# Altium schematic sheet Buck converter_ADJ.SchDoc
size A; SheetNumber: 2; SheetTotal: 3
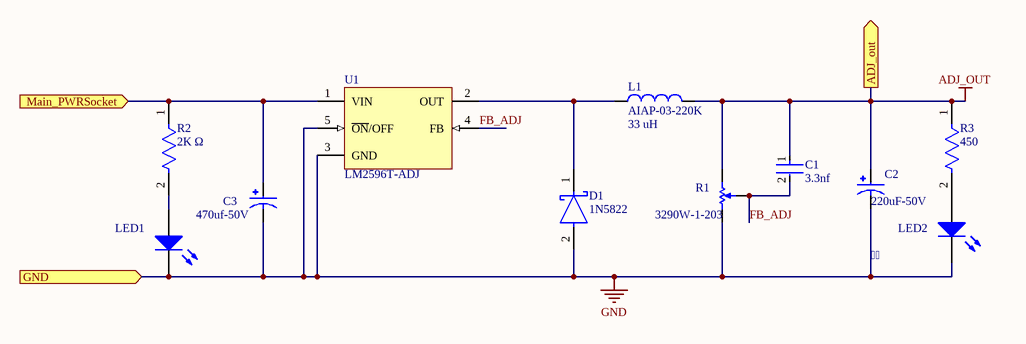
[diagram p0: Buck converter_ADJ.SchDoc]

## Parts
C1  3.3nf  [FP-RCE0K1-MFG]
C2  220uF-50V  [CAPPRD500W60D1000H1600]
C3  470uf-50V  [CAPPRD500W60D1250H2000]
D1  1N5822  [FP-DO-201AD-MFG]
L1  AIAP-03-220K  Inductance: 33 uH  [ABRA-AIAP-02-2_V2]
LED1  (no value)  [Type 5mm]
LED2    [Type 5mm]
R1  3290W-1-203  [BOUR-3290W]
R2  value 2K Ω  [FP-MFR-25-MFG]  (hidden comment: MFR-25FBF52-1K18)
R3  value 450  [FP-MFR-25-MFG]  (hidden comment: MFR-25FBF52-1K18)
U1  LM2596T-ADJ  [NDH0005A]

## Ports
ADJ_out (out), GND (in), Main_PWRSocket (in)

## Nets
ADJ_OUT: C1.1 C2.P L1.2 R1.3 R3.1 ; port ADJ_out
GND: C2.N C3.N D1.2(A) LED1.1(K) LED2.1(K) R1.1 U1.3(GND) U1.5(~{ON}/OFF) ; port GND
FB_ADJ: C1.2 R1.2 U1.4(FB)
Main_PWRSocket: C3.P R2.1 U1.1(VIN) ; port Main_PWRSocket
NetD1_1: D1.1(C) L1.1 U1.2(OUT)
NetLED1_2: LED1.2(A) R2.2
NetLED2_2: LED2.2(A) R3.2

## Library data of the parts
C1 = CMP-06035-016735-1: Cap Ceramic 15pF 50V C0G ±5% Radial 5mm +125°C Automotive Bulk; Lead/Base Style: Formed Leads; Lead Diameter: 0.5mm; Height: 3.5mm; Ratings: AEC-Q200; Lead Pitch: 0.197inch; Termination: Radial; Packaging: Tape and Reel; Voltage Rating (DC): 50V; Length: 0.142inch; Width: 0.098inch; Tolerance: 5%; Package Quantity: 2000; Min Operating Temperature: -55°C; Height - Seated (Max): 0.138inch; Voltage Rating: 50V; Capacitance: 15pF; Case/Package: Radial; Max Operating Temperature: 125°C; Resistor Type: Ceramic; Mount: Through Hole; Dielectric: C0G
C2 = EEUFM1H221: FM-A; MF: {'manufacturer': u'Panasonic'}; Price: None; Availability: Unavailable; MP: EEUFM1H221; Package: None; Value: *
C3 = EEUFM1H471: FM-A; MF: {'manufacturer': u'Panasonic'}; Price: None; Availability: Unavailable; Value: *; MP: EEUFM1H471; Package: None
D1 = CMP-12187-000025-1: DIODE SCHOTTKY 40V 3A DO201AD; Manufacturer: STMicroelectronics; Max Junction Temp: +150°C; Peak Reverse Current: 2mA; Max Surge Forward Current: 80A; Temperature Range High: +150°C; Automotive: No; RoHS: TRUE; ComponentLink2Description: Datasheet; Manufacturer Part Number: 1N5822; Lead Free: Yes; Octopart: https://octopart.com/1n5822-stmicroelectronics-323225; Device Class L2: Diodes; Max Repetitive Reverse Voltage: 40V; Temperature: to +150°C; Height: 5.3mm; Category: Diode; Digikey Description: DIODE SCHOTTKY 40V 3A DO201AD; ComponentLink2URL: https://www.st.com/resource/en/datasheet/1n5822.pdf; Device Class L3: Schottky Diodes; Device Class L1: Discrete Semiconductors; Forward Current: 3A; Mouser Description: Schottky Diodes & Rectifiers Vr/40V Io/3A BULK; Package: DO-201AD
L1 = CMP-0740-00001-1: Axial Power Inductor, 1000 uH +/- 10%, 0.4 A Max, 2.3 Ohm Max, -40 to 85 degC, 6.4 mm Dia x 14 mm Length, RoHS, Bag; PartNumber: AIAP-02-102K; Manufacturer: Abracon; DCR Max: 2.3 Ohm; IDC Max: 0.4 A; Tolerance: +/- 10%; ComponentLink2Description: Datasheet; ComponentLink3Description: Package Specification; RoHS: TRUE; Operating Temperature: -40 to 85 degC; ComponentLink1Description: Manufacturer URL; PackageVersion: Rev. 02.12.12; PackageReference: AIAP-02-2; ComponentLink1URL: http://www.abracon.com/; DatasheetVersion: 2/12/2012; ComponentLink2URL: http://www.abracon.com/Magnetics/axial/AIAP-02.pdf; Packing: Bag; PackageDescription: 2-Pin Axial Leaded, Dia 6.4 mm, Length 14 mm; Mounting Technology: Through Hole; ComponentLink3URL: http://www.abracon.com/Magnetics/axial/AIAP-02.pdf
LED1 LED2 = CMP-1488-00007-1: THT LED round mono-color color lens, WL-TMRW, Bright Green; PartNumber: 151051VS04000; Manufacturer: Wuerth Elektronik; Emitting color: Bright Green; ComponentLink1Description: Manufacturer URL; PackageReference: Type 5mm; ComponentLink2URL: http://katalog.we-online.de/pbs/datasheet/7448042001.pdfhttp://katalog.we-online.de/pbs/datasheet/7448042001.pdfhttp://katalog.we-online.de/pbs/datasheet/7448042001.pdfhttp://katalog.we-online.de/pbs/datasheet/151051VS04000.pdf; ComponentLink1URL: http://www.we-online.com; ComponentLink2Description: Datasheet
R1 = CMP-2000-05581-1: Trimming Potentiometer, 20 KOhm, 1 W, -65 to 150 degC, 3-Pin THD, RoHS, Tube; Manufacturer: Bourns; No. of Turns: 25; Potentiometer Mounting: ThroughHole; Temperature Coefficient: ±50ppm/°C; Power Rating: 1W; SVHC: NoSVHC(15-Jun-2015); Resistance Tolerance: ±5%; Product Range: AEC-Q2003290WSeries; Track Resistance: 20kohm; Datasheet URL: http://www.bourns.com/docs/Product-Datasheets/3290.pdf; Datasheet Version: 04/2014; Mounting Technology: ThroughHole; Package Description: 3-Pin Through Hole Device, Body 9.53 x 3.81 mm, Pitch 2.54 mm; Manufacturer URL: http://www.bourns.com/; Package Reference: 3290W
R2 R3 = CMP-03413-000001-1: RES 1.18K OHM 1/4W 1% AXIAL; Manufacturer: Yageo; Temperature Coefficient: 100ppm/°C; Power Rating: 0.25W; Voltage Rating: 250V; Resistance: 10K Ω; Temperature: -55°C to +155°C; Automotive: No; Temperature Range High: +155°C; Mouser Description: Metal Film Resistors 1.18K OHM 1/4W 1%; Digikey Description: RES 1.18K OHM 1/4W 1% AXIAL; Lead Free: Yes; Tolerance: 1%; ComponentLink2Description: Datasheet; ComponentLink2URL: https://www.yageo.com/upload/media/product/products/datasheet/lr/Yageo_LR_MFR_1.pdf; Temperature Range Low: -55°C; Package: MFR-25; Ipc Land Pattern Name: RESAD1000W75L680D260; Composition: Metal Film; Category: Res; Octopart: https://octopart.com/mfr-25fbf52-1k18-yageo-56251681; Series: MFR; Device Class L2: Resistors; Height: 2.6mm; Device Class L3: Through-Hole Resistors; Manufacturer Part Number: MFR-25FBF52-1K18; RoHS: TRUE; Device Class L1: Passive Components
U1 = CMP-0069-01927-3: SIMPLE SWITCHER® Power Converter 150 KHz 3A Step-Down Voltage Regulator, 5-pin TO-220; Manufacturer: Texas Instruments; PackageTopMarking: NSUZXYTTE#*LM2596T*-ADJ P+; PowerWise: N; CompType: Switcher; RoHS: N; PackageReference: NDH0005A; ComponentLink1Description: Datasheet URL; PackageDescription: TO-220, Molded, Stagger Bend, 5 Lead; PinCount: 5; ComponentLink1URL: http://www.ti.com/general/docs/lit/getliterature.tsp?genericPartNumber=LM2596&fileType=pdf